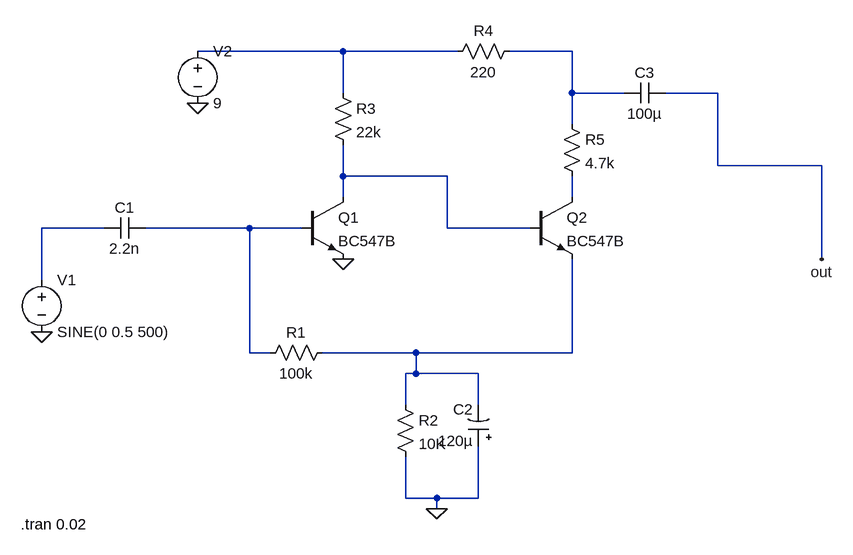
[diagram p0: schematic npnFuzz.asc]
npnFuzz.asc, the LTspice schematic file:
Version 4
SHEET 1 1276 680
WIRE 448 -160 224 -160
WIRE 624 -160 448 -160
WIRE 800 -160 704 -160
WIRE 448 -96 448 -160
WIRE 800 -96 800 -160
WIRE 880 -96 800 -96
WIRE 1024 -96 944 -96
WIRE 800 -48 800 -96
WIRE 1024 16 1024 -96
WIRE 1184 16 1024 16
WIRE 448 32 448 -16
WIRE 608 32 448 32
WIRE 448 64 448 32
WIRE 800 64 800 32
WIRE 80 112 -16 112
WIRE 304 112 144 112
WIRE 384 112 304 112
WIRE 608 112 608 32
WIRE 736 112 608 112
WIRE 1184 160 1184 16
WIRE -16 192 -16 112
WIRE 304 304 304 112
WIRE 336 304 304 304
WIRE 560 304 416 304
WIRE 800 304 800 160
WIRE 800 304 560 304
WIRE 560 336 560 304
WIRE 560 336 544 336
WIRE 656 336 560 336
WIRE 544 384 544 336
WIRE 656 384 656 336
WIRE 544 528 544 464
WIRE 592 528 544 528
WIRE 656 528 656 448
WIRE 656 528 592 528
WIRE 592 544 592 528
FLAG -16 272 0
FLAG 448 160 0
FLAG 592 544 0
FLAG 1184 160 out
FLAG 224 -80 0
DATAFLAG 800 -80 ""
DATAFLAG 656 336 ""
SYMBOL voltage -16 176 R0
WINDOW 123 0 0 Left 2
WINDOW 39 0 0 Left 2
SYMATTR InstName V1
SYMATTR Value SINE(0 0.5 500)
SYMBOL cap 144 96 R90
WINDOW 0 0 32 VBottom 2
WINDOW 3 32 32 VTop 2
SYMATTR InstName C1
SYMATTR Value 2.2n
SYMBOL npn 384 64 R0
SYMATTR InstName Q1
SYMATTR Value BC547B
SYMBOL res 432 288 R90
WINDOW 0 0 56 VBottom 2
WINDOW 3 32 56 VTop 2
SYMATTR InstName R1
SYMATTR Value 100k
SYMBOL polcap 672 448 R180
WINDOW 0 24 57 Left 2
WINDOW 3 24 8 Left 2
SYMATTR InstName C2
SYMATTR Value 120µ
SYMATTR Description Capacitor
SYMATTR Type cap
SYMATTR SpiceLine V=6.3 Irms=4.08248 Rser=0.015 Lser=0 mfg="KEMET" pn="A700D127M006ATE015" type="Al electrolytic"
SYMBOL res 528 368 R0
SYMATTR InstName R2
SYMATTR Value 10K
SYMBOL res 432 -112 R0
SYMATTR InstName R3
SYMATTR Value 22k
SYMBOL res 720 -176 R90
WINDOW 0 0 56 VBottom 2
WINDOW 3 32 56 VTop 2
SYMATTR InstName R4
SYMATTR Value 220
SYMBOL res 784 -64 R0
SYMATTR InstName R5
SYMATTR Value 4.7k
SYMBOL npn 736 64 R0
SYMATTR InstName Q2
SYMATTR Value BC547B
SYMBOL cap 944 -112 R90
WINDOW 0 0 32 VBottom 2
WINDOW 3 32 32 VTop 2
SYMATTR InstName C3
SYMATTR Value 100µ
SYMBOL voltage 224 -176 R0
WINDOW 123 0 0 Left 2
WINDOW 39 0 0 Left 2
SYMATTR InstName V2
SYMATTR Value 9
TEXT -48 568 Left 2 !.tran 0.02

The netlist it stands for:
* npnFuzz.asc
V1 N005 0 SINE(0 0.5 500)
C1 N006 N005 2.2n
Q1 N003 N006 0 0 BC547B
R1 N007 N006 100k
C2 0 N007 120µ V=6.3 Irms=4.08248 Rser=0.015 Lser=0 mfg="KEMET" pn="A700D127M006ATE015" type="Al electrolytic"
R2 N007 0 10K
R3 N001 N003 22k
R4 N002 N001 220
R5 N002 N004 4.7k
Q2 N004 N003 N007 0 BC547B
C3 out N002 100µ
V2 N001 0 9
.model NPN NPN
.model PNP PNP
.lib standard.bjt
.tran 0.02
.backanno
.end